# EAGLE design v2 (EAGLE 7.3.0)
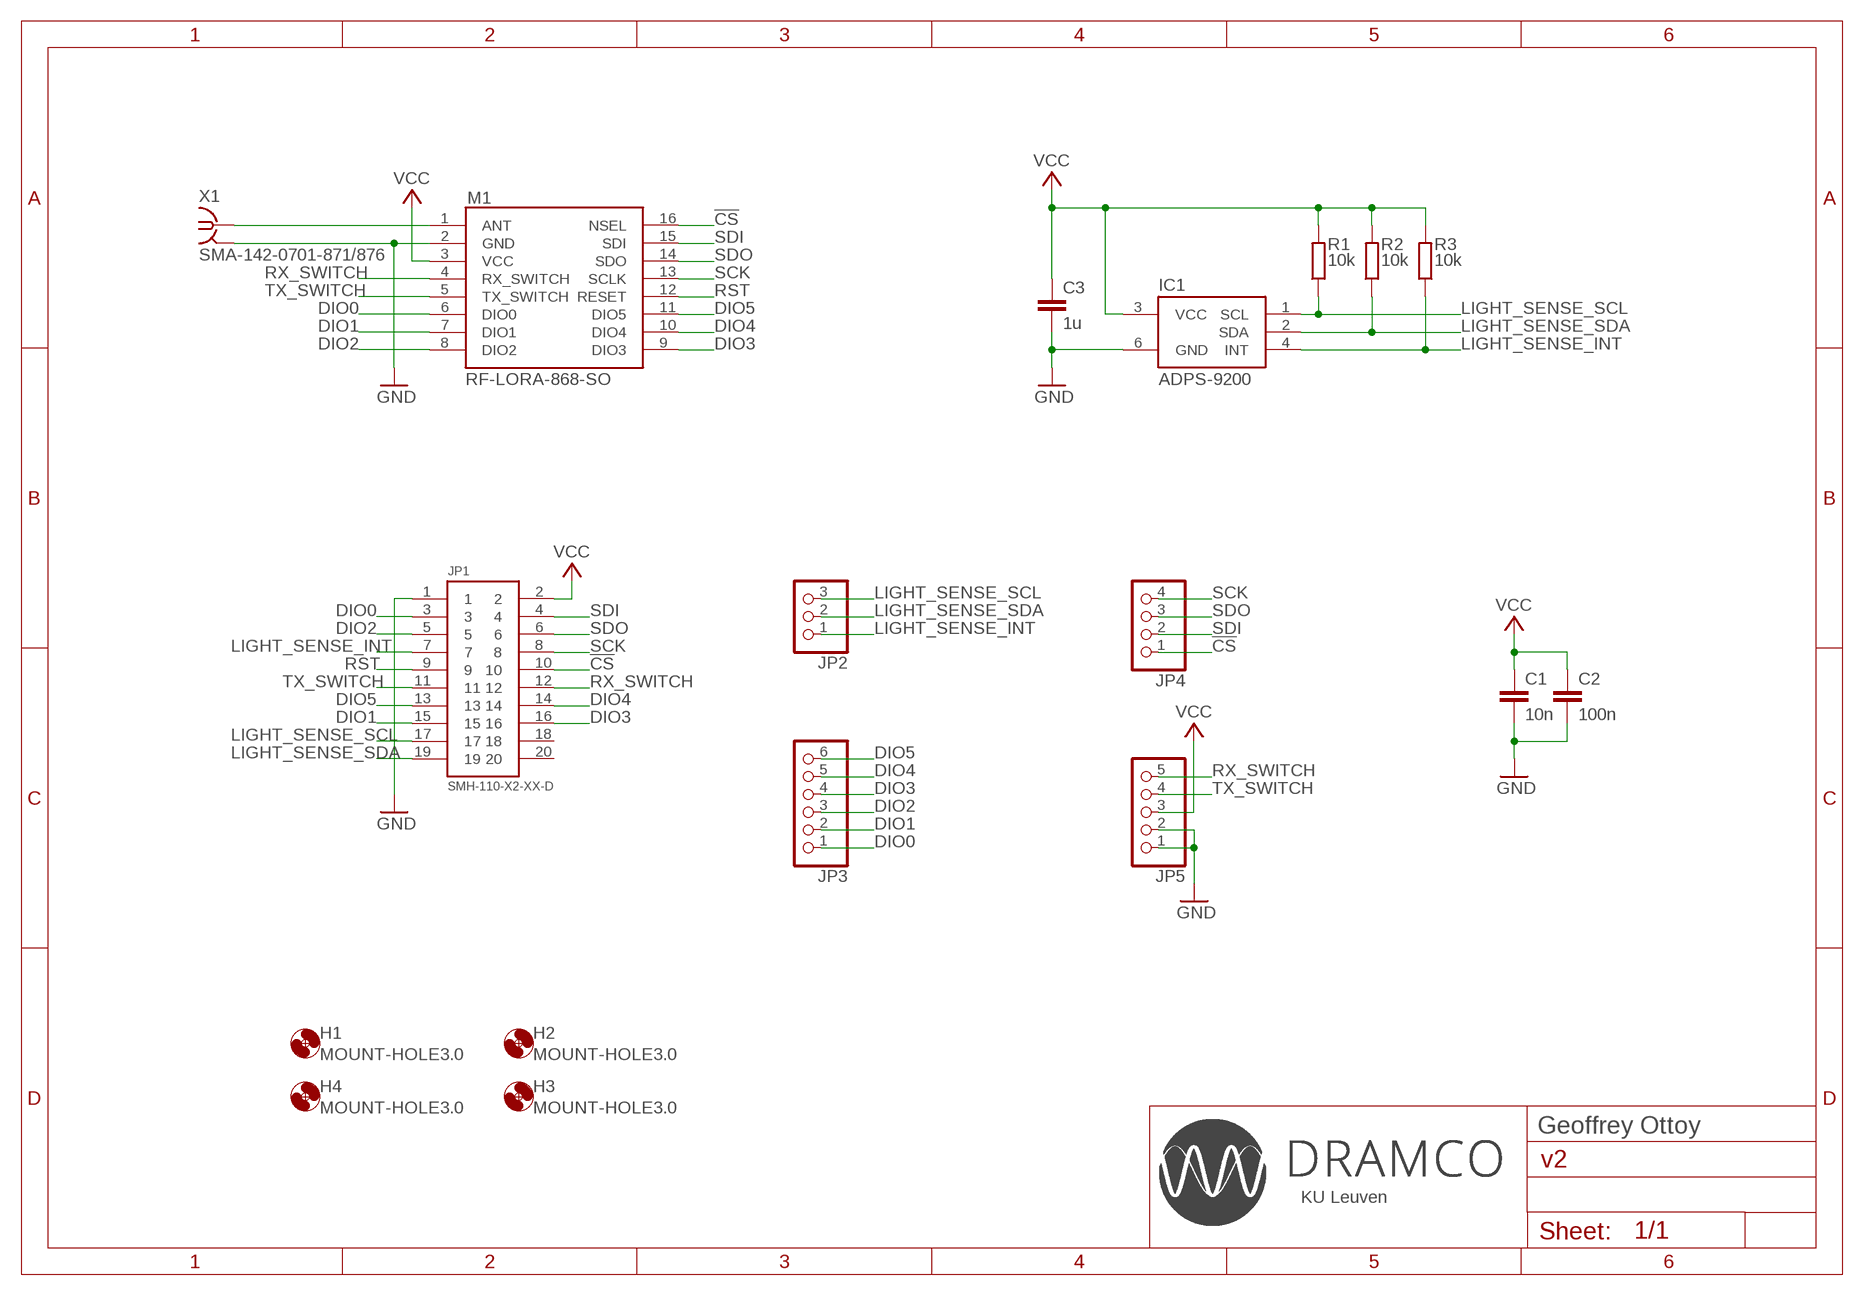
[diagram p0: schematic, sheet 1]

## Parts
C1  10n  C-EUC0805K  [C0805K]
C2  100n  C-EUC0805K  [C0805K]
C3  1u  C-EUC0805K  [C0805K]
H1  MOUNT-HOLE3.0  [3,0]
H2  MOUNT-HOLE3.0  [3,0]
H3  MOUNT-HOLE3.0  [3,0]
H4  MOUNT-HOLE3.0  [3,0]
IC1  ADPS-9200  [ADPS-9200]
JP1  SMH-110-X2-XX-D  [SMH-110-X2-XX-D]
JP2  PINHD-1X3  [1X03]
JP3  PINHD-1X6  [1X06]
JP4  PINHD-1X4  [1X04]
JP5  PINHD-1X5  [1X05]
M1  RF-LORA-868-SO  [RF-LORA-868-SO]
R1  10k  R-EU_M0805  [M0805]
R2  10k  R-EU_M0805  [M0805]
R3  10k  R-EU_M0805  [M0805]
X1  SMA-142-0701-871/876  [J502-ND-142-0701-871/876]

## Nets
!CS: JP1.10 JP4.1 M1.16(NSEL)
ANT: M1.1(ANT) X1.1
DIO0: JP1.3 JP3.1 M1.6(DIO0)
DIO1: JP1.15 JP3.2 M1.7(DIO1)
DIO2: JP1.5 JP3.3 M1.8(DIO2)
DIO3: JP1.16 JP3.4 M1.9(DIO3)
DIO4: JP1.14 JP3.5 M1.10(DIO4)
DIO5: JP1.13 JP3.6 M1.11(DIO5)
GND: C1.2 C2.2 C3.2 IC1.6(GND) JP1.1 JP5.1 JP5.2 M1.2(GND) X1.G@1 X1.G@2 X1.G@3 X1.G@4
LIGHT_SENSE_INT: IC1.4(INT) JP1.7 JP2.1 R3.1
LIGHT_SENSE_SCL: IC1.1(SCL) JP1.17 JP2.3 R1.1
LIGHT_SENSE_SDA: IC1.2(SDA) JP1.19 JP2.2 R2.1
RST: JP1.9 M1.12(RESET)
RX_SWITCH: JP1.12 JP5.5 M1.4(RX_SWITCH)
SCK: JP1.8 JP4.4 M1.13(SCLK)
SDI: JP1.4 JP4.2 M1.15(SDI)
SDO: JP1.6 JP4.3 M1.14(SDO)
TX_SWITCH: JP1.11 JP5.4 M1.5(TX_SWITCH)
VCC: C1.1 C2.1 C3.1 IC1.3(VCC) JP1.2 JP5.3 M1.3(VCC) R1.2 R2.2 R3.2
Unconnected: JP1.18 JP1.20

## Notes on the sheet
- Geoffrey Ottoy
- KU Leuven

## Library data of the parts
C1-C3 = rcl:C-EU: CAPACITOR, European symbol
H1-H4 = holes:MOUNT-HOLE: MOUNTING HOLE with drill center marker
IC1 = project:ADPS-9200
JP1 = project:SMH-110-X2-XX-D
JP2 = pinhead:PINHD-1X3: PIN HEADER
JP3 = pinhead:PINHD-1X6: PIN HEADER
JP4 = pinhead:PINHD-1X4: PIN HEADER
JP5 = pinhead:PINHD-1X5: PIN HEADER
M1 = project:RF-LORA-868-SO
R1-R3 = rcl:R-EU_: RESISTOR, European symbol
X1 = con-coax:SMA-: SMA 50 Ohm End Launch Jack Receptacle - Round Contact Johnson Components Source: www.johnsoncomponents.com .. J502-ND.pdf; MF: JOHNSON COMPONENTS; MPN: 142-0701-871; OC_FARNELL: 1339835; OC_NEWARK: 91B6105

## Board
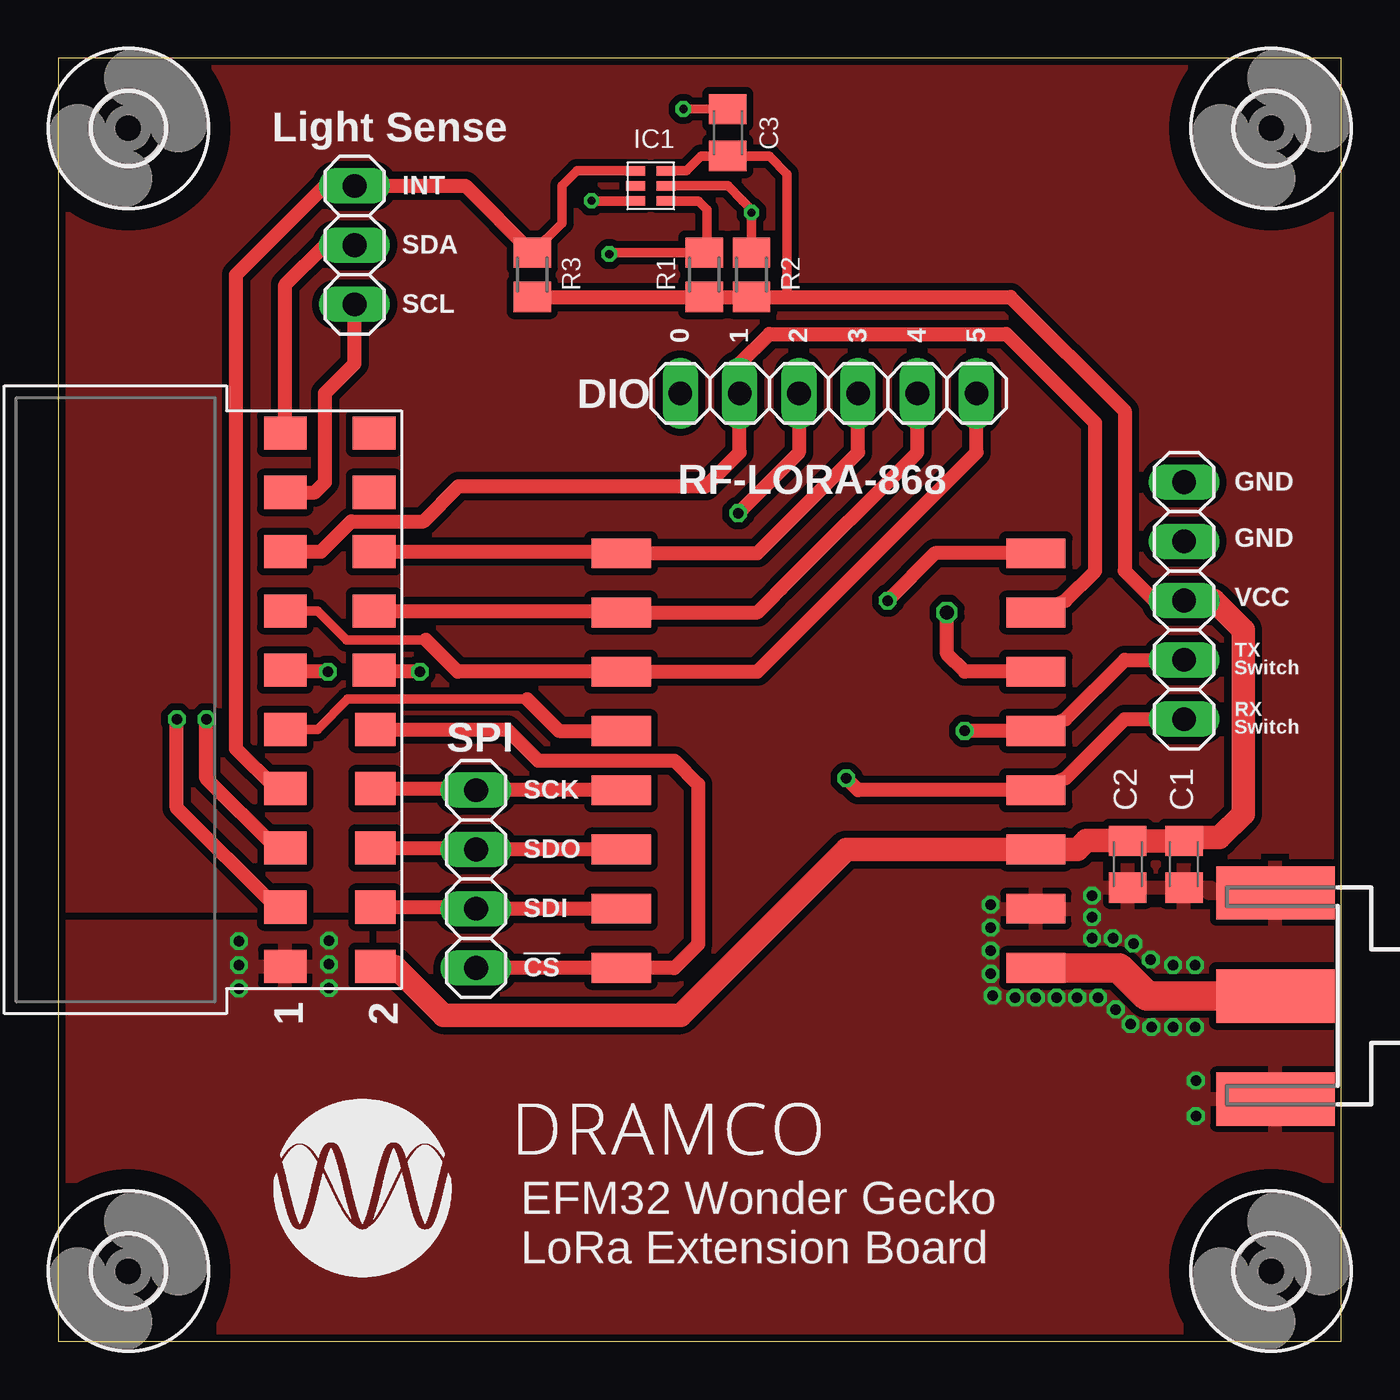
[diagram p1: board, top side]
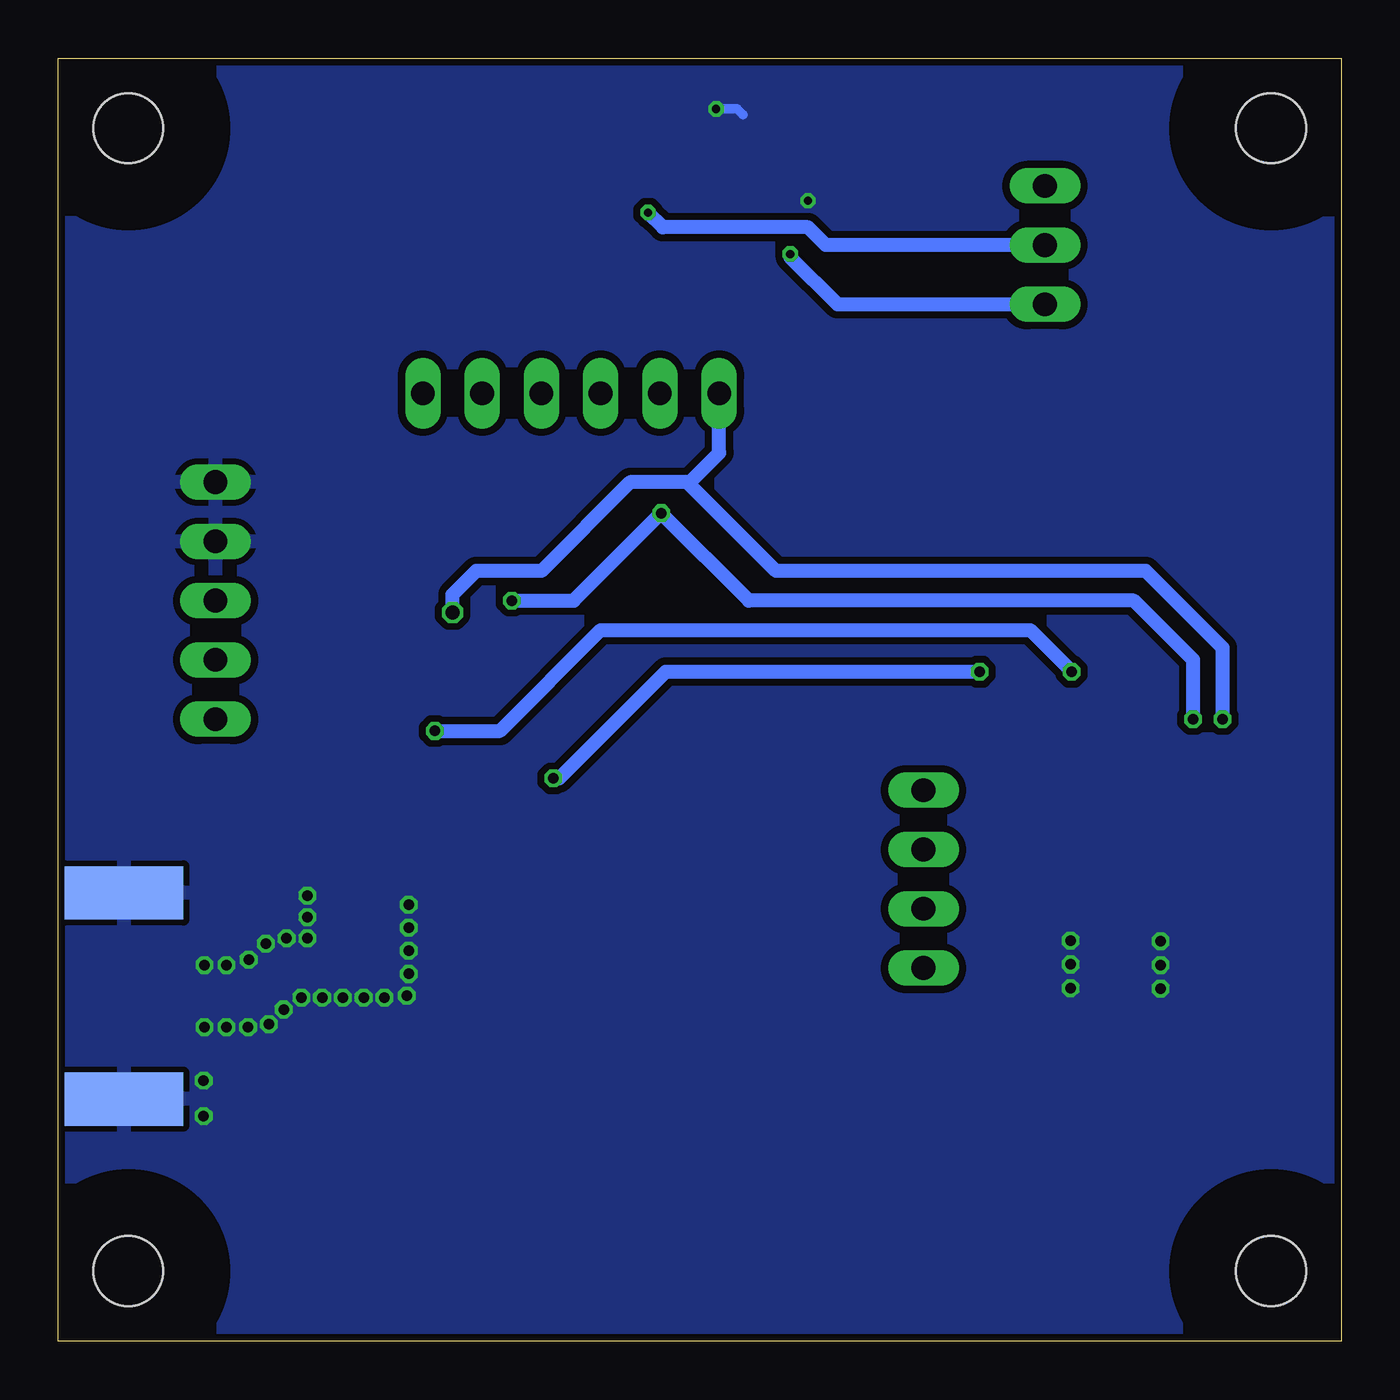
[diagram p2: board, bottom side, seen from below]

Size 55 x 55 mm. Coordinates in mm from the lower left corner, seen from the top.
Outline: 0,0 55,0 55,55 0,55 0,0
Copper layers (1*16): Top 0.035mm / dielectric 1.5mm / Bottom 0.035mm
Design rules "SeeedStudio_2layer_DRU_no_angle_20140221-1": minimum track width 6mil, minimum drill 12mil, track to track 6mil, track to pad 6mil, pad to pad 6mil, via to via 6mil, smd to smd 0mil, copper to edge 10mil, drill to drill 10mil, minimum pad ring 10mil, minimum via ring 6mil, stop-mask expansion 2mil, vias tented up to drill 100mil, thermal gap 10mil

### Footprints (pad centres in the part's own frame; a part is rotated, then mirrored left to right if it is on the bottom)
C0805K = smd 1.3 x 1.6: 1 -1,0; 2 1,0
3,0 = hole 3: 0,0
ADPS-9200 = smd 0.406 x 0.813: 1 -0.65,-0.65; 2 0,-0.65; 3 0.65,-0.65; 4 0.65,0.65; 5 0,0.65; 6 -0.65,0.65
SMH-110-X2-XX-D = smd 1.422 x 1.829: 1 11.43,-1.27; 3 8.89,-1.27; 5 6.35,-1.27; 7 3.81,-1.27; 9 1.27,-1.27; 11 -1.27,-1.27; 12 -1.27,2.54; 13 -3.81,-1.27; 14 -3.81,2.54; 15 -6.35,-1.27; 16 -6.35,2.54; 17 -8.89,-1.27; 18 -8.89,2.54; 19 -11.43,-1.27; 20 -11.43,2.54 | smd 1.422 x 1.727: 2 11.43,2.591; 4 8.89,2.591; 6 6.35,2.591; 8 3.81,2.591; 10 1.27,2.591
1X03 = drill 1.016 long: 1 -2.54,0; 2 0,0; 3 2.54,0
1X06 = drill 1.016 long: 1 -6.35,0; 2 -3.81,0; 3 -1.27,0; 4 1.27,0; 5 3.81,0; 6 6.35,0
1X04 = drill 1.016 long: 1 -3.81,0; 2 -1.27,0; 3 1.27,0; 4 3.81,0
1X05 = drill 1.016 long: 1 -5.08,0; 2 -2.54,0; 3 0,0; 4 2.54,0; 5 5.08,0
RF-LORA-868-SO = smd 2.54 x 1.27: 1 -8.89,8.89; 2 -8.89,6.35; 3 -8.89,3.81; 4 -8.89,1.27; 5 -8.89,-1.27; 6 -8.89,-3.81; 7 -8.89,-6.35; 8 -8.89,-8.89; 9 8.89,-8.89; 10 8.89,-6.35; 11 8.89,-3.81; 12 8.89,-1.27; 13 8.89,1.27; 14 8.89,3.81; 15 8.89,6.35; 16 8.89,8.89
M0805 = smd 1.3 x 1.6: 1 -0.95,0; 2 0.95,0
J502-ND-142-0701-871/876 = smd 5.08 x 2.286: 1 2.565,0; G@1 2.565,4.42; G@2 2.565,-4.42 | smd 5.08 x 2.286 bottom: G@3 2.565,4.42; G@4 2.565,-4.42

### Placement (x,y rotation side)
C1  48.26,20.45 270 top
C2  45.85,20.45 270 top
C3  28.7,51.82 90 top
H1  3,3 0 top
H2  52,3 0 top
H3  52,52 0 top
H4  3,52 0 top
IC1  25.4,49.53 90 top
JP1  11,27.5 270 top
JP2  12.7,46.99 270 top
JP3  33.02,40.64 0 top
JP4  17.91,19.81 90 top
JP5  48.26,31.75 270 top
M1  33.02,24.89 180 top
R1  27.69,45.72 270 top
R2  29.72,45.72 270 top
R3  20.32,45.72 270 top
X1  54.75,14.8 180 top

### Tracks (layer width: path | path; a pad name or v marks a point on that pad's centre or on a via)
!CS
  Top 0.61: JP4.1 M1.16 26.42,16 27.43,17.02 27.43,23.88 26.42,24.89 20.57,24.89 19.24,26.23 JP1.10
ANT
  Top 1.27: M1.1 45.47,16 46.67,14.8 X1.1
DIO0  (via drill 0.45, 0.6)
  Top 0.61: JP1.3 9.33,18.61 5.08,22.86 v5.08,26.67 | M1.6 38.86,28.7 38.1,29.46 v38.1,31.24
  Bottom 0.61: v5.08,26.67 5.08,29.72 8.38,33.02 24.23,33.02 28.04,36.83 | JP3.1 26.67,38.1 26.66,38.09 27.92,36.83 28.04,36.83 | 28.04,36.83 30.48,36.83 34.29,33.02 37.08,33.02 38.1,32 v38.1,31.24
DIO1
  Top 0.61: JP1.15 11.27,33.85 12.56,35.15 15.65,35.15 17.16,36.65 27.76,36.65 29.21,38.1 JP3.2 29.21,41.91 30.48,43.18 40.64,43.18 44.45,39.37 44.45,33.02 43.18,31.75 M1.7
DIO2  (via drill 0.45)
  Top 0.61: JP1.5 9.33,21.15 6.35,24.13 v6.35,26.67 | JP3.3 31.75,38.1 v29.15,35.5 | M1.8 37.59,33.78 v35.56,31.75
  Bottom 0.61: v6.35,26.67 6.35,29.21 8.89,31.75 25.4,31.75 v29.15,35.5 32.9,31.75 v35.56,31.75
DIO3
  Top 0.61: JP3.4 34.29,38.1 29.97,33.78 M1.9 24.06,33.85 JP1.16
DIO4
  Top 0.61: JP3.5 36.83,38.1 30.99,32.26 30.48,31.75 29.97,31.24 M1.10 24.06,31.31 JP1.14
DIO5
  Top 0.406: 15.76,30.07 12.35,30.07 11.11,31.31 JP1.13
  Top 0.61: JP3.6 39.37,38.1 29.97,28.7 M1.11 17.13,28.7 15.76,30.07
GND  (via drill 0.35, 0.45)
  Top 0.406: IC1.6 22.86,48.88 v22.86,48.9 | C3.2 28.56,52.82 v26.8,52.83
  Top 0.61: 48.26,19.07 C1.2
  Bottom 0.406: v26.8,52.83 25.91,52.83 25.65,52.58
  other vias: 45.97,13.59 7.75,17.14 46.86,13.46 7.75,16.13 11.61,16.15 47.8,16.13 46.84,16.36 46.1,17.04 44.58,14.73 45.34,14.22 44.32,18.19 39.98,18.72 39.98,17.73 39.98,16.74 39.98,15.75 41.91,14.73 42.8,14.73 43.69,14.73 7.75,15.11 11.61,17.17 11.61,15.14 48.74,16.13 48.77,11.18 48.77,9.65 47.8,13.47 41.02,14.73 40.06,14.81 48.74,13.47 44.32,17.27 45.21,17.27 44.32,19.1
  pour Bottom (isolate 0.305): 0,54.61 54.61,54.61 54.61,0 0,0
  pour Top (isolate 0.305): 0,17.78 12.7,17.78 16.51,13.97 27.94,13.97 34.29,20.32 54.61,20.32 54.61,0 0,0
LIGHT_SENSE_INT
  Top 0.406: R3.1 21.59,47.94 21.59,49.53 22.24,50.18 IC1.4
  Top 0.61: R3.1 17.46,49.53 JP2.1 11.43,49.53 7.62,45.72 7.62,25.4 9.33,23.69 JP1.7
LIGHT_SENSE_SCL  (via drill 0.35)
  Top 0.406: 26.6,46.67 R1.1 | IC1.1 27.45,48.88 27.81,48.51 27.81,46.8 R1.1 | R1.1 23.68,46.67 v23.62,46.61
  Top 0.61: JP1.17 10.99,36.39 11.43,36.83 11.43,40.64 12.7,41.91 JP2.3
  Bottom 0.406: v23.62,46.61 23.62,46.48
  Bottom 0.61: JP2.3 21.59,44.45 23.62,46.48
LIGHT_SENSE_SDA  (via drill 0.35)
  Top 0.406: IC1.2 28.7,49.53 29.34,48.9 29.72,48.51 v29.72,48.39 R2.1
  Top 0.61: JP1.19 9.73,45.29 11.43,46.99 JP2.2
  Bottom 0.61: JP2.2 22.1,46.99 22.86,47.75 29.08,47.75 v29.72,48.39
RST
  Top 0.406: JP1.9 11.12,26.23 12.41,27.52 20.1,27.52
  Top 0.61: 20.1,27.52 21.46,26.16 M1.12
RX_SWITCH  (via drill 0.45)
  Top 0.61: JP5.5 45.72,26.67 43.18,24.13 M1.4 34.29,23.62 v33.78,24.13 | v15.49,28.7 13.61,28.7 JP1.12
  Bottom 0.61: v15.49,28.7 28.96,28.7 33.53,24.13 v33.78,24.13
SCK
  Top 0.61: JP1.8 17.85,23.69 JP4.4 M1.13
SDI
  Top 0.61: JP1.4 17.85,18.61 JP4.2 M1.15
SDO
  Top 0.61: JP1.6 17.85,21.15 JP4.3 M1.14
TEST
  pour Top (isolate 0.305, rank 2): 0,55 0,14 55,14 55,55
TX_SWITCH  (via drill 0.45)
  Top 0.61: JP5.4 45.72,29.21 43.18,26.67 M1.5 v38.86,26.16 | v11.56,28.7 9.8,28.7 JP1.11
  Bottom 0.61: v11.56,28.7 13.34,30.48 31.75,30.48 36.07,26.16 v38.86,26.16
VCC
  Top 0.406: IC1.3 26.94,50.18 27.56,50.8 28.69,50.8 C3.1 28.72,50.8 30.48,50.8 31.24,50.04 31.24,44.7 31.18,44.77 R1.2
  Top 0.61: 47.99,21.59 C1.1 48.26,21.59 | C2.1 45.72,21.56 45.75,21.59 | R3.2 R1.2 R2.2 40.83,44.77 45.72,39.88 45.72,33.02 46.99,31.75 JP5.3
  Top 1.016: JP5.3 49.53,31.75 50.8,30.48 50.8,22.61 49.78,21.59 48.26,21.59 | JP1.2 14.41,16.07 16.51,13.97 26.67,13.97 33.78,21.08 M1.3 43.69,21.08 44.07,21.46 45.83,21.46 C2.1 C1.1

### Text on the board
tSilkscreen: Light Sense | INT | SDA | SCL | 0 | 1 | 2 | 3 | 4 | 5 | DIO | RF-LORA-868 | GND | GND | VCC | Switch | TX | RX | Switch | SPI | SCK | SDO | SDI | !CS | EFM32 Wonder Gecko / LoRa Extension Board
101bmp: Designed by: / Geoffrey Ottoy, Gilles Callebaut, / Guus Leenders | KU Leuven - Technology Campus Ghent | DRAMCO research group | EFM32 Wonder Gecko | LoRa Extension Board (v2.0)